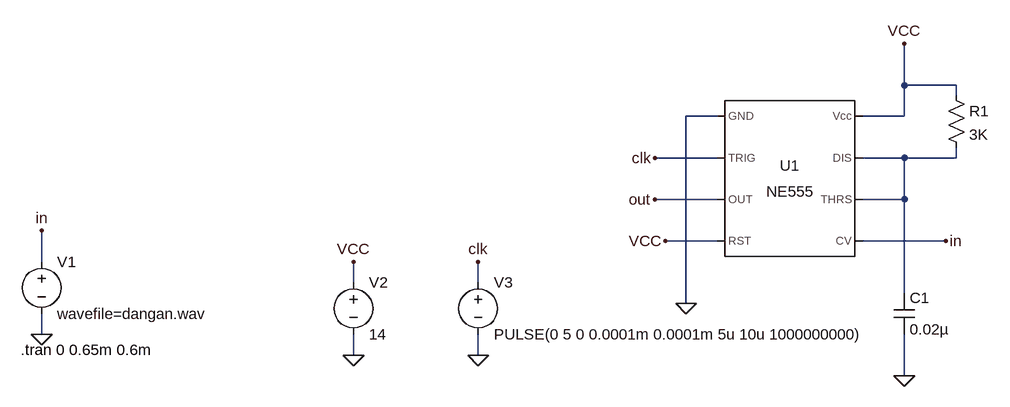
[diagram p0: schematic 555.asc]
555.asc, the LTspice schematic file:
Version 4
SHEET 1 1272 680
WIRE 1136 80 1136 16
WIRE 1216 80 1136 80
WIRE 1216 96 1216 80
WIRE 848 128 800 128
WIRE 1136 128 1136 80
WIRE 1136 128 1072 128
WIRE 848 192 752 192
WIRE 1136 192 1072 192
WIRE 1216 192 1216 176
WIRE 1216 192 1136 192
WIRE 848 256 752 256
WIRE 1136 256 1136 192
WIRE 1136 256 1072 256
WIRE 848 320 768 320
WIRE 1200 320 1072 320
WIRE -192 352 -192 304
WIRE 288 384 288 352
WIRE 480 384 480 352
WIRE 1136 400 1136 256
WIRE 800 416 800 128
WIRE -192 464 -192 432
WIRE 288 496 288 464
WIRE 480 496 480 464
WIRE 1136 528 1136 464
FLAG -192 464 0
FLAG -192 304 in
FLAG 800 416 0
FLAG 288 496 0
FLAG 288 352 VCC
FLAG 1136 16 VCC
FLAG 1136 528 0
FLAG 768 320 VCC
FLAG 1200 320 in
FLAG 480 496 0
FLAG 480 352 clk
FLAG 752 192 clk
FLAG 752 256 out
SYMBOL voltage -192 336 R0
WINDOW 123 0 0 Left 0
WINDOW 39 0 0 Left 0
SYMATTR InstName V1
SYMATTR Value wavefile=dangan.wav
SYMBOL Misc\\NE555 960 224 R0
SYMATTR InstName U1
SYMBOL voltage 288 368 R0
WINDOW 123 0 0 Left 0
WINDOW 39 0 0 Left 0
SYMATTR InstName V2
SYMATTR Value 14
SYMBOL cap 1120 400 R0
SYMATTR InstName C1
SYMATTR Value 0.02µ
SYMBOL res 1200 80 R0
SYMATTR InstName R1
SYMATTR Value 3K
SYMBOL voltage 480 368 R0
WINDOW 123 0 0 Left 0
WINDOW 39 0 0 Left 0
SYMATTR InstName V3
SYMATTR Value PULSE(0 5 0 0.0001m 0.0001m 5u 10u 1000000000)
TEXT -224 488 Left 2 !.tran 0 0.65m 0.6m

The netlist it stands for:
* 555.asc
V1 in 0 wavefile=dangan.wav
XU1 0 clk out VCC in N001 N001 VCC NE555  ; pins GND TRIG OUT RST CV THRS DIS Vcc
V2 VCC 0 14
C1 N001 0 0.02µ
R1 VCC N001 3K
V3 clk 0 PULSE(0 5 0 0.0001m 0.0001m 5u 10u 1000000000)
.tran 0 0.65m 0.6m
.lib NE555.sub
.backanno
.end